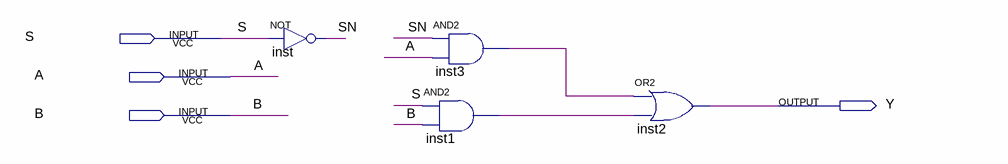
[diagram p0: schematic sheet]
// Quartus schematic Mux2_1bit.bdf as structural Verilog: 4 symbols, 4 pins
module Mux2_1bit (
  input  S,
  input  A,
  input  B,
  output Y
);

  wire inst1_out, inst3_out, SN;

  not inst (SN, S);
  and inst3 (inst3_out, SN, A);
  and inst1 (inst1_out, S, B);
  or inst2 (Y, inst3_out, inst1_out);
endmodule
